# Altium project MultiMeter.PrjPcb
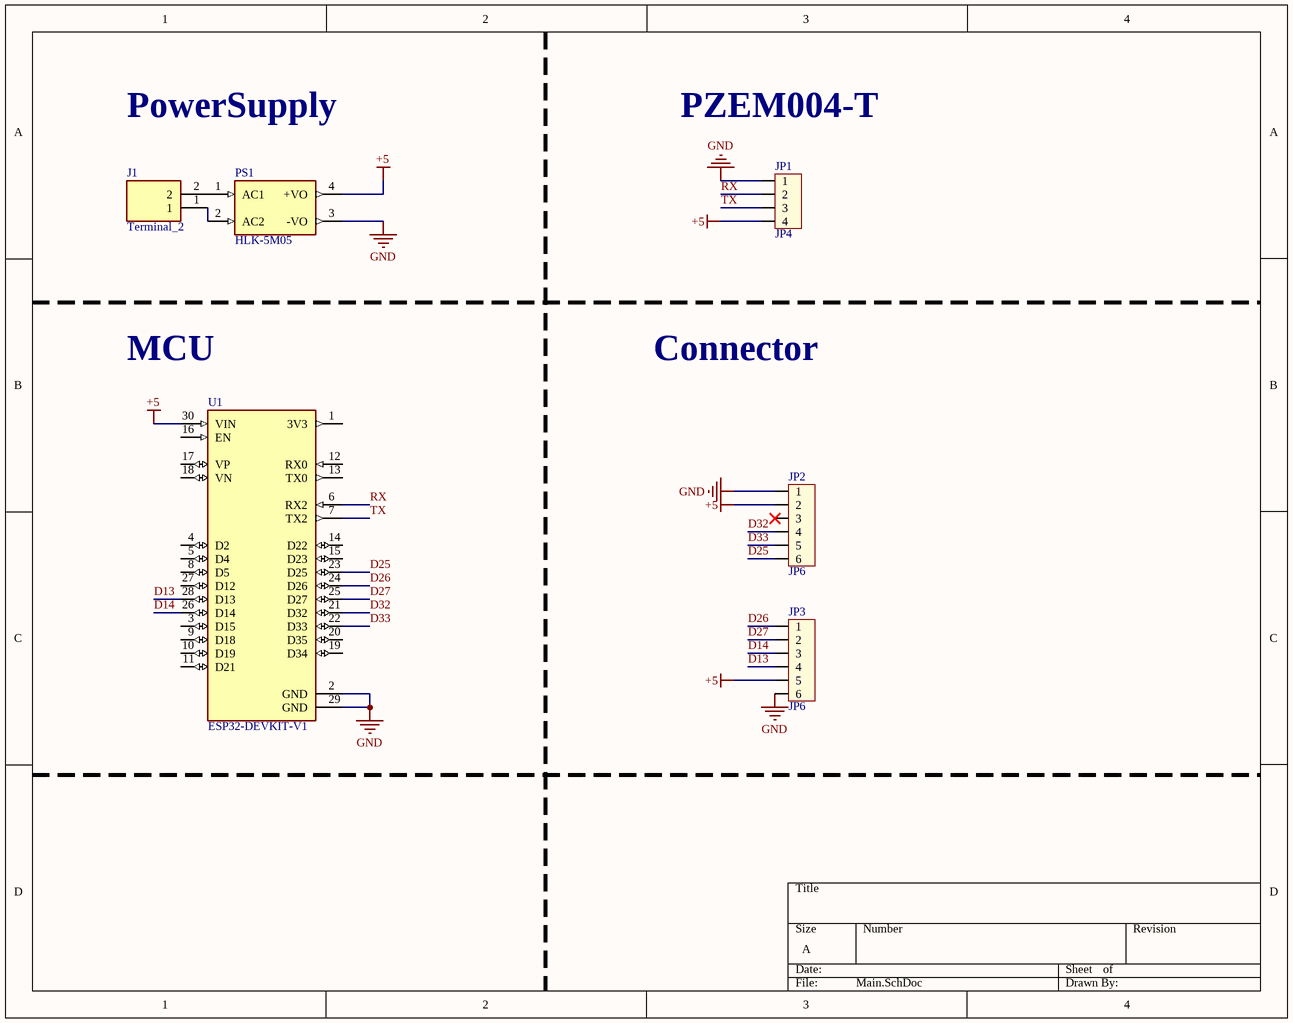
[diagram p0: Main.SchDoc]
2 sheets, 13 parts. Net scope: global (net labels, ports and power ports of the same name join across sheets).
Board file: PCB3.PcbDoc
Sheets:
  Main.SchDoc
  Connector.SchDoc

## Sheet Main.SchDoc
size A; SheetNumber: 1; SheetTotal: 2

### Parts
J1  Terminal_2  [TE_282843-2]
JP1  JP4  [CON4]
JP2  JP6  [CON6]
JP3  JP6  [CON6]
PS1  HLK-5M05  [CONV_HLK-5M05]
U1  ESP32-DEVKIT-V1  [MODULE_ESP32_DEVKIT_V1]

### Nets
+5: JP1.4 JP2.2 JP3.5 PS1.4(+VO) U1.30(VIN)
GND: JP1.1 JP2.1 JP3.6 PS1.3(-VO) U1.2(GND) U1.29(GND)
D13: JP3.4 U1.28(D13)
D14: JP3.3 U1.26(D14)
D25: JP2.6 U1.23(D25)
D26: JP3.1 U1.24(D26)
D27: JP3.2 U1.25(D27)
D32: JP2.4 U1.21(D32)
D33: JP2.5 U1.22(D33)
RX: JP1.2 U1.6(RX2)
TX: JP1.3 U1.7(TX2)
NetJ1_1: J1.1 PS1.2(AC2)
NetJ1_2: J1.2 PS1.1(AC1)

Not connected (* = marked no-connect by the designer): JP2 3*; U1 1(3V3) 3(D15) 4(D2) 5(D4) 8(D5) 9(D18) 10(D19) 11(D21) 12(RX0) 13(TX0) 14(D22) 15(D23) 16(EN) 17(VP) 18(VN) 19(D34) 20(D35) 27(D12)

### Notes on the sheet
- PowerSupply
- PZEM004-T
- MCU
- Connector

### Library data of the parts
J1 = 282843-2: MF: {'manufacturer': 'TE Connectivity'}; Availability: Unavailable; MP: 282843-2; Value: *; Package: None; Price: None
JP1 = Con4: Connector 4; Value: Connector 4
JP2 JP3 = Con6: Connector 6; Value: Connector 6
PS1 = HLK-5M05: AC DC 220V to 5V 5W 5Watt Isolated Switching Step-Down Power Supply Module Converter; MF: Hi-link; Check_prices: https://www.snapeda.com/parts/HLK-5M05/Hi-link/view-part/?ref=eda; SnapEDA_Link: https://www.snapeda.com/parts/HLK-5M05/Hi-link/view-part/?ref=snap; Price: None; Availability: Not in stock; Package: Package; MP: HLK-5M05; Value: *
U1 = ESP32-DEVKIT-V1: Dual core, Wi-Fi: 2.4 GHz up to 150 Mbits/s,BLE (Bluetooth Low Energy) and legacy Bluetooth, 32 bits, Up to 240 MHz; MF: Do it; Price: None; Availability: Not in stock; Package: None; MP: ESP32-DEVKIT-V1; Value: *; SnapEDA_Link: https://www.snapeda.com/parts/ESP32-DEVKIT-V1/Do+it/view-part/?ref=snap; Check_prices: https://www.snapeda.com/parts/ESP32-DEVKIT-V1/Do+it/view-part/?ref=eda

## Sheet Connector.SchDoc
size A; SheetNumber: 2; SheetTotal: 2
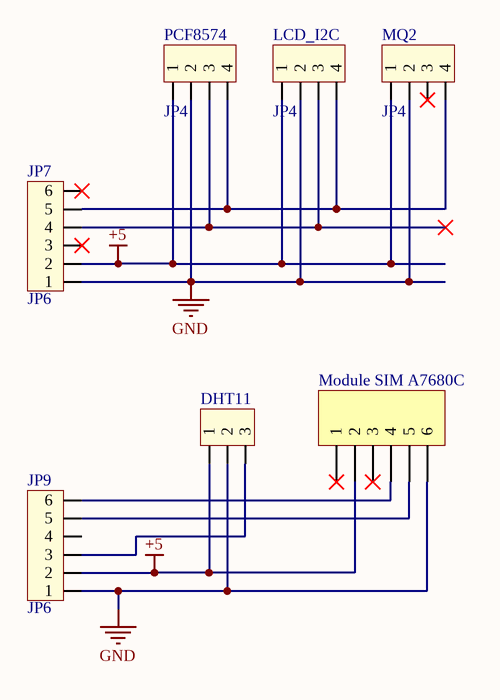
[diagram p1: Connector.SchDoc]

### Parts
DHT11  (no value)  [CON3]
JP7  JP6  [CON6]
JP9  JP6  [CON6]
LCD_I2C  JP4  [CON4]
Module_SIM_A7680C  (no value)  [Header 6]
MQ2  JP4  [CON4]
PCF8574  JP4  [CON4]

### Nets
+5: DHT11.1 JP7.2 JP9.2 LCD_I2C.1 Module_SIM_A7680C.2 MQ2.1 PCF8574.1
GND: DHT11.2 JP7.1 JP9.1 LCD_I2C.2 Module_SIM_A7680C.6 MQ2.2 PCF8574.2
NetDHT11_3: DHT11.3 JP9.3
NetJP7_4: JP7.4 LCD_I2C.3 PCF8574.3
NetJP7_5: JP7.5 LCD_I2C.4 MQ2.4 PCF8574.4
NetJP9_5: JP9.5 Module_SIM_A7680C.5
NetJP9_6: JP9.6 Module_SIM_A7680C.4

Not connected (* = marked no-connect by the designer): JP7 3* 6*; JP9 4; Module_SIM_A7680C 1* 3*; MQ2 3*

### Library data of the parts
DHT11 = Con3: Connector 3; Value: Connector 3
JP7 JP9 = Con6: Connector 6; Value: Connector 6
LCD_I2C MQ2 PCF8574 = Con4: Connector 4; Value: Connector 4
Module_SIM_A7680C = Header 6: Header, 6-Pin; LatestRevisionDate: 17-Jul-2002; LatestRevisionNote: Re-released for DXP Platform.; Publisher: Altium Limited

## Nets that join several sheets
+5: Main (5 pins), Connector (7 pins)
GND: Main (6 pins), Connector (7 pins)